# Altium schematic sheet RTC.SchDoc
size A4
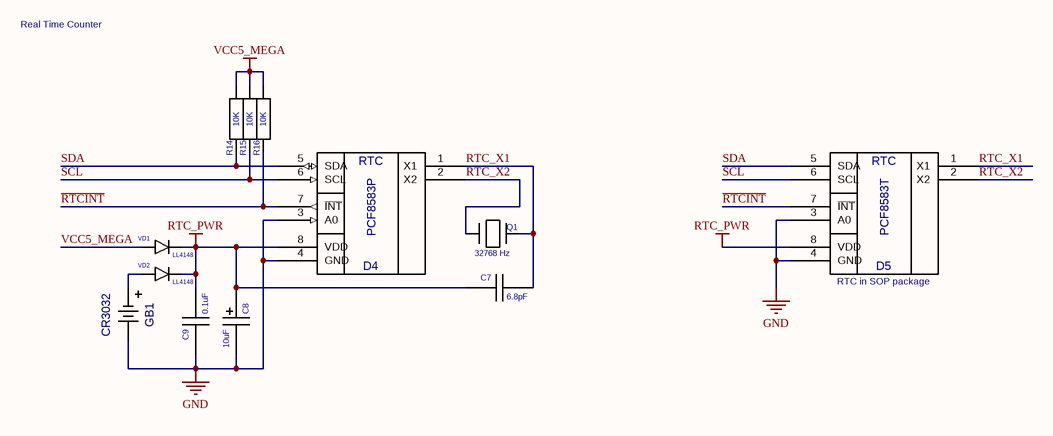
[diagram p0: RTC.SchDoc]

## Parts
C7  value 6.8pF  [C-CHIP]  (hidden comment: CAPCHIP)
C8  value 10uF  [EC-CHIP]  (hidden comment: ECAPCHIP)
C9  value 0.1uF  [C-CHIP]  (hidden comment: CAPCHIP)
D4  PCF8583P  [DIP8]
D5  PCF8583T  [PCF8583T]
GB1  value CR3032  [BAT]  (hidden comment: BAT)
Q1  value 32768 Hz  [32768]  (hidden comment: QUARTZ32768)
R14  value 10K  [R-CHIP]  (hidden comment: RESCHIP)
R15  value 10K  [R-CHIP]  (hidden comment: RESCHIP)
R16  value 10K  [R-CHIP]  (hidden comment: RESCHIP)
VD1  LL4148  [LL4148]
VD2  LL4148  [LL4148]

## Nets
GND: C8.2 C9.1 D4.3(A0) D4.4(GND) D5.3(A0) D5.4(GND) GB1.2(MINUS) Q1.3(GND)
RTC_PWR: C7.1 C8.1 C9.2 D4.8(VDD) D5.8(VDD) VD1.2(C) VD2.2(C)
VCC5_MEGA: R14.1(i/o) R15.1(i/o) R16.1(i/o) VD1.1(A)
~{RTCINT}: D4.7(~{INT}) D5.7(~{INT}) R16.2(i/o1)
RTC_X1: C7.2 D4.1(X1) D5.1(X1) Q1.1
RTC_X2: D4.2(X2) D5.2(X2) Q1.2
SCL: D4.6(SCL) D5.6(SCL) R15.2(i/o1)
SDA: D4.5(SDA) D5.5(SDA) R14.2(i/o1)
NetGB1_1: GB1.1(PLUS) VD2.1(A)

## Notes on the sheet
- Real Time Counter
- (near D5) RTC in SOP package
- (in symbol PCF8583P) RTC
- (in symbol PCF8583T) RTC

## Library data of the parts
D4 = PCF8583P: Value: *
D5 = PCF8583T: Value: *
VD1 VD2 = LL4148: Value: *